# EAGLE design NavegacionPlaca (EAGLE 9.6.2)
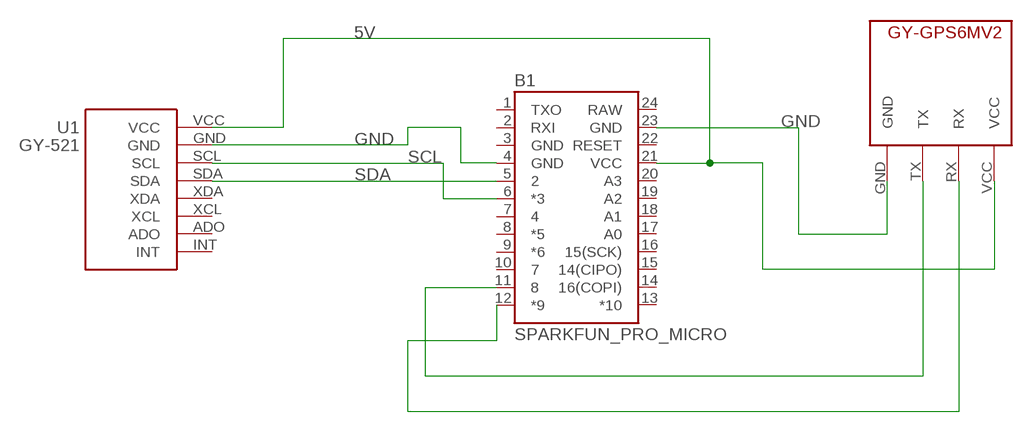
[diagram p0: schematic, sheet 1]

## Parts
B1  SPARKFUN_PRO_MICRO  [SPARKFUN_PRO_MICRO]
U1  GY-521  [GY-521]
U$1  GY-GPS6MV2LIB  [GY-GPS6M_FOOTPRINT]

## Nets
5V: B1.21(VCC) U1.VCC U$1.VCC
GND: B1.4(GND) B1.23(GND) U1.GND U$1.GND
N$3: B1.11 U$1.TX
N$4: B1.12(*9) U$1.RX
SCL: B1.6(*3) U1.SCL
SDA: B1.5 U1.SDA
Unconnected: B1.1(TXO) B1.2(RXI) B1.7 B1.8(*5) B1.9(*6) B1.10 B1.13(*10) B1.14(16(COPI)) B1.15(14(CIPO)) B1.16(15(SCK)) B1.17(A0) B1.18(A1) B1.19(A2) B1.20(A3) B1.22(RESET) U1.ADO U1.INT U1.XCL U1.XDA

## Power pins joined to a net without a drawn wire
GND: B1.3(GND)
RAW: B1.24(RAW)

## Library data of the parts
B1 = SparkFun-Boards:SPARKFUN_PRO_MICRO: SparkFun Pro Micro Atmega32U4 compatible footprint. SparkFun Products: 3.3V/8MHz <https://www.sparkfun.com/products/12587> 5V/16MHz <https://www.sparkfun.com/products/12640>
U1 = GY-521:GY-521: Check availability <https://pricing.snapeda.com/parts/GY-521/GODREAM%20FORDREAM%20CO.%2C%20LIMITED/view-part?ref=eda>; AVAILABILITY: Not in stock; DESCRIPTION: Triple Axis Accelerometer Gyro Breakout; MF: GODREAM FORDREAM CO., LIMITED; MP: GY-521; PACKAGE: Package; PRICE: None
U$1 = GY-GPS6M2:GY-GPS6MV2LIB

## Net classes
0 default: width 0.305 mm, clearance 0.305 mm

## Board
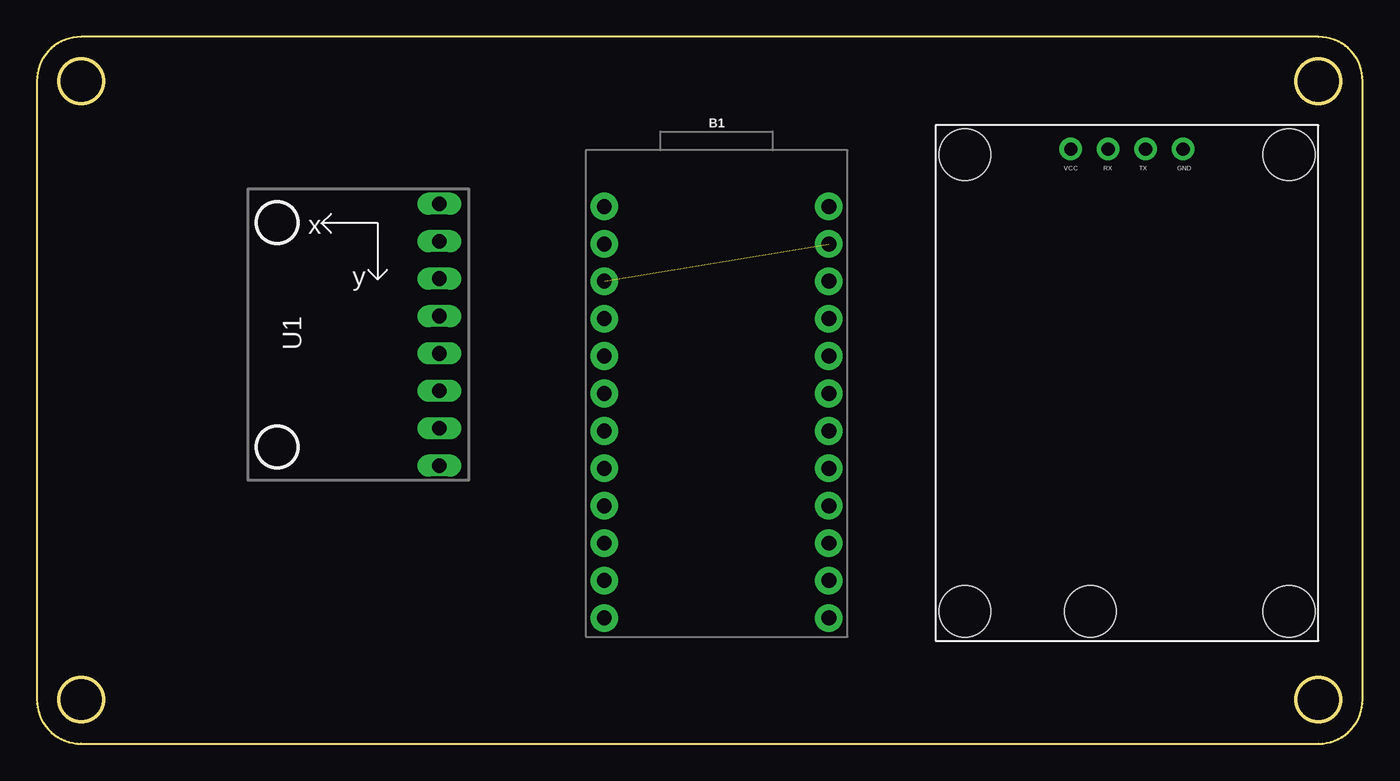
[diagram p1: board, top side]
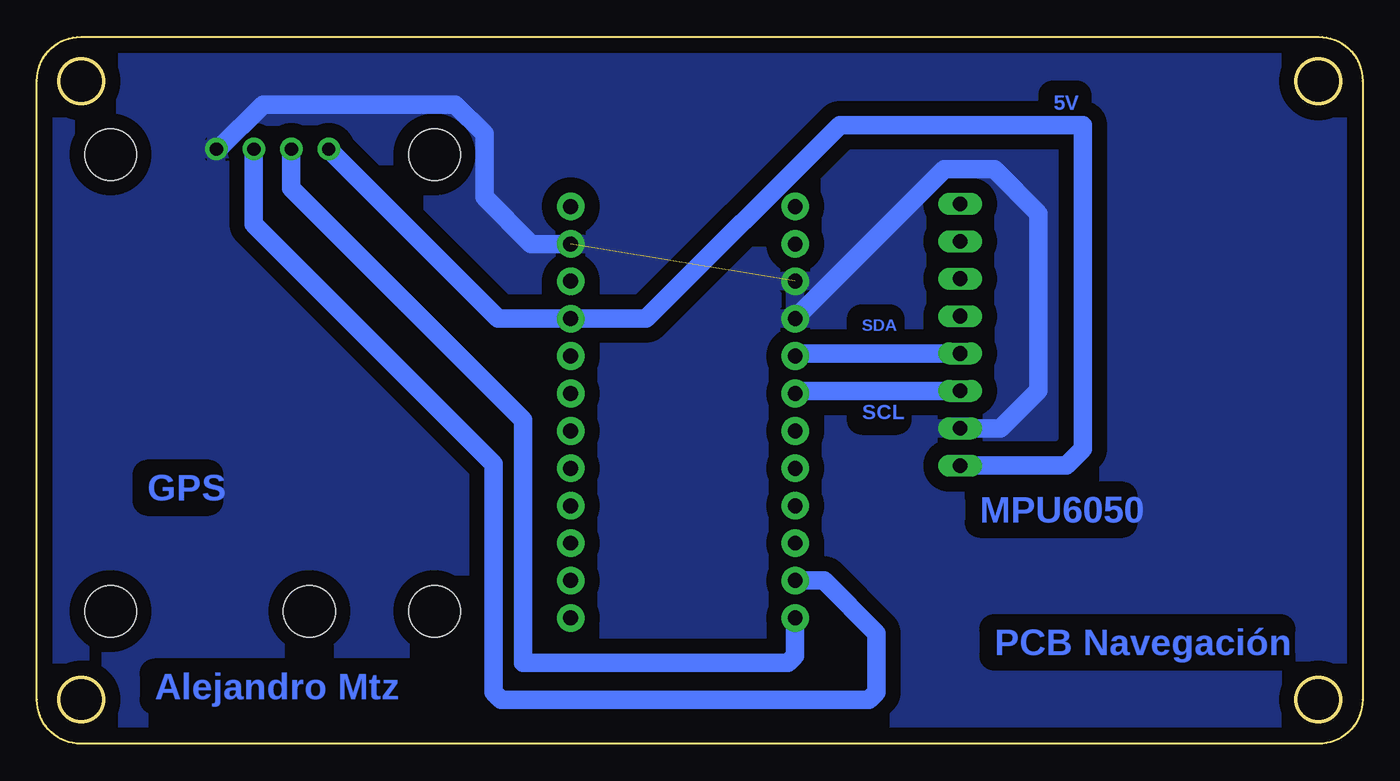
[diagram p2: board, bottom side, seen from below]

Size 90 x 48 mm. Coordinates in mm from the lower left corner, seen from the top.
Outline: 3,0 87,0 arc90 90,3 90,45 arc90 87,48 3,48 arc90 0,45 0,3 arc90 3,0
Outline: circle at 3,3 radius 1.5
Outline: circle at 3,45 radius 1.5
Outline: circle at 87,45 radius 1.5
Outline: circle at 87,3 radius 1.5
Copper layers (1*16): Top 0.035mm / dielectric 1.5mm / Bottom 0.035mm
Design rules "default": minimum track width 6mil, minimum drill 0.35mm, track to track 6mil, track to pad 6mil, pad to pad 6mil, via to via 6mil, smd to smd 6mil, copper to edge 40mil, drill to drill 6mil, minimum pad ring 10mil, minimum via ring 8mil, stop-mask expansion 4mil, vias tented up to drill 0mil, thermal gap 10mil

### Footprints (pad centres in the part's own frame; a part is rotated, then mirrored left to right if it is on the bottom)
SPARKFUN_PRO_MICRO = drill 1.016 pad 1.88: 1 -7.62,12.7; 2 -7.62,10.16; 3 -7.62,7.62; 4 -7.62,5.08; 5 -7.62,2.54; 6 -7.62,0; 7 -7.62,-2.54; 8 -7.62,-5.08; 9 -7.62,-7.62; 10 -7.62,-10.16; 11 -7.62,-12.7; 12 -7.62,-15.24; 13 7.62,-15.24; 14 7.62,-12.7; 15 7.62,-10.16; 16 7.62,-7.62; 17 7.62,-5.08; 18 7.62,-2.54; 19 7.62,0; 20 7.62,2.54; 21 7.62,5.08; 22 7.62,7.62; 23 7.62,10.16; 24 7.62,12.7
GY-521 = drill 1 long: ADO 0,-15.24; GND 0,-2.54; INT 0,-17.78; SCL 0,-5.08; SDA 0,-7.62; VCC 0,0; XCL 0,-10.16; XDA 0,-12.7
GY-GPS6M_FOOTPRINT = drill 0.91 pad 1.524: GND 16.81,33.375; RX 11.73,33.375; TX 14.27,33.375; VCC 9.19,33.375 | hole 3.5: 2,33; 24,33; 2,2; 24,2; 10.5,2

### Placement (x,y rotation side)
B1  46.14,23.78 0 top
U1  27.33,18.88 180 top
U$1  61,7 0 top

### Tracks (layer width: path | path; a pad name or v marks a point on that pad's centre or on a via)
5V
  Bottom 1.27: U1.VCC 20.12,18.88 19,20 19,42 35.5,42 48.64,28.86 B1.21 58.67,28.86 U$1.VCC
GND  (1 unrouted)
  Bottom 1.27: U1.GND 24.58,21.42 22,24 22,36 25,39 28.38,39 B1.4 | U$1.GND 77.68,40.38 74.65,43.4 61.59,43.4 59.6,41.41 59.6,37.1 56.44,33.94 B1.23
  pour Bottom (isolate 1.016): 0,0 0,48 90,48 90,0
N$3
  Bottom 1.27: U$1.TX 75.27,35.27 59,19 59,3.5 58.5,3 33.5,3 33,3.5 33,7.5 36.58,11.08 B1.11
N$4
  Bottom 1.27: U$1.RX 72.73,37.73 57,22 57,5.5 39,5.5 38.52,5.98 B1.12
SCL
  Bottom 1.27: U1.SCL 38.34,23.96 B1.6
SDA
  Bottom 1.27: U1.SDA 38.34,26.5 B1.5

### Text on the board
Bottom: 5V | SDA | SCL | GPS | MPU6050 | PCB Navegación | Alejandro Mtz